# EAGLE design Thruster Ctl (EAGLE 5.06)
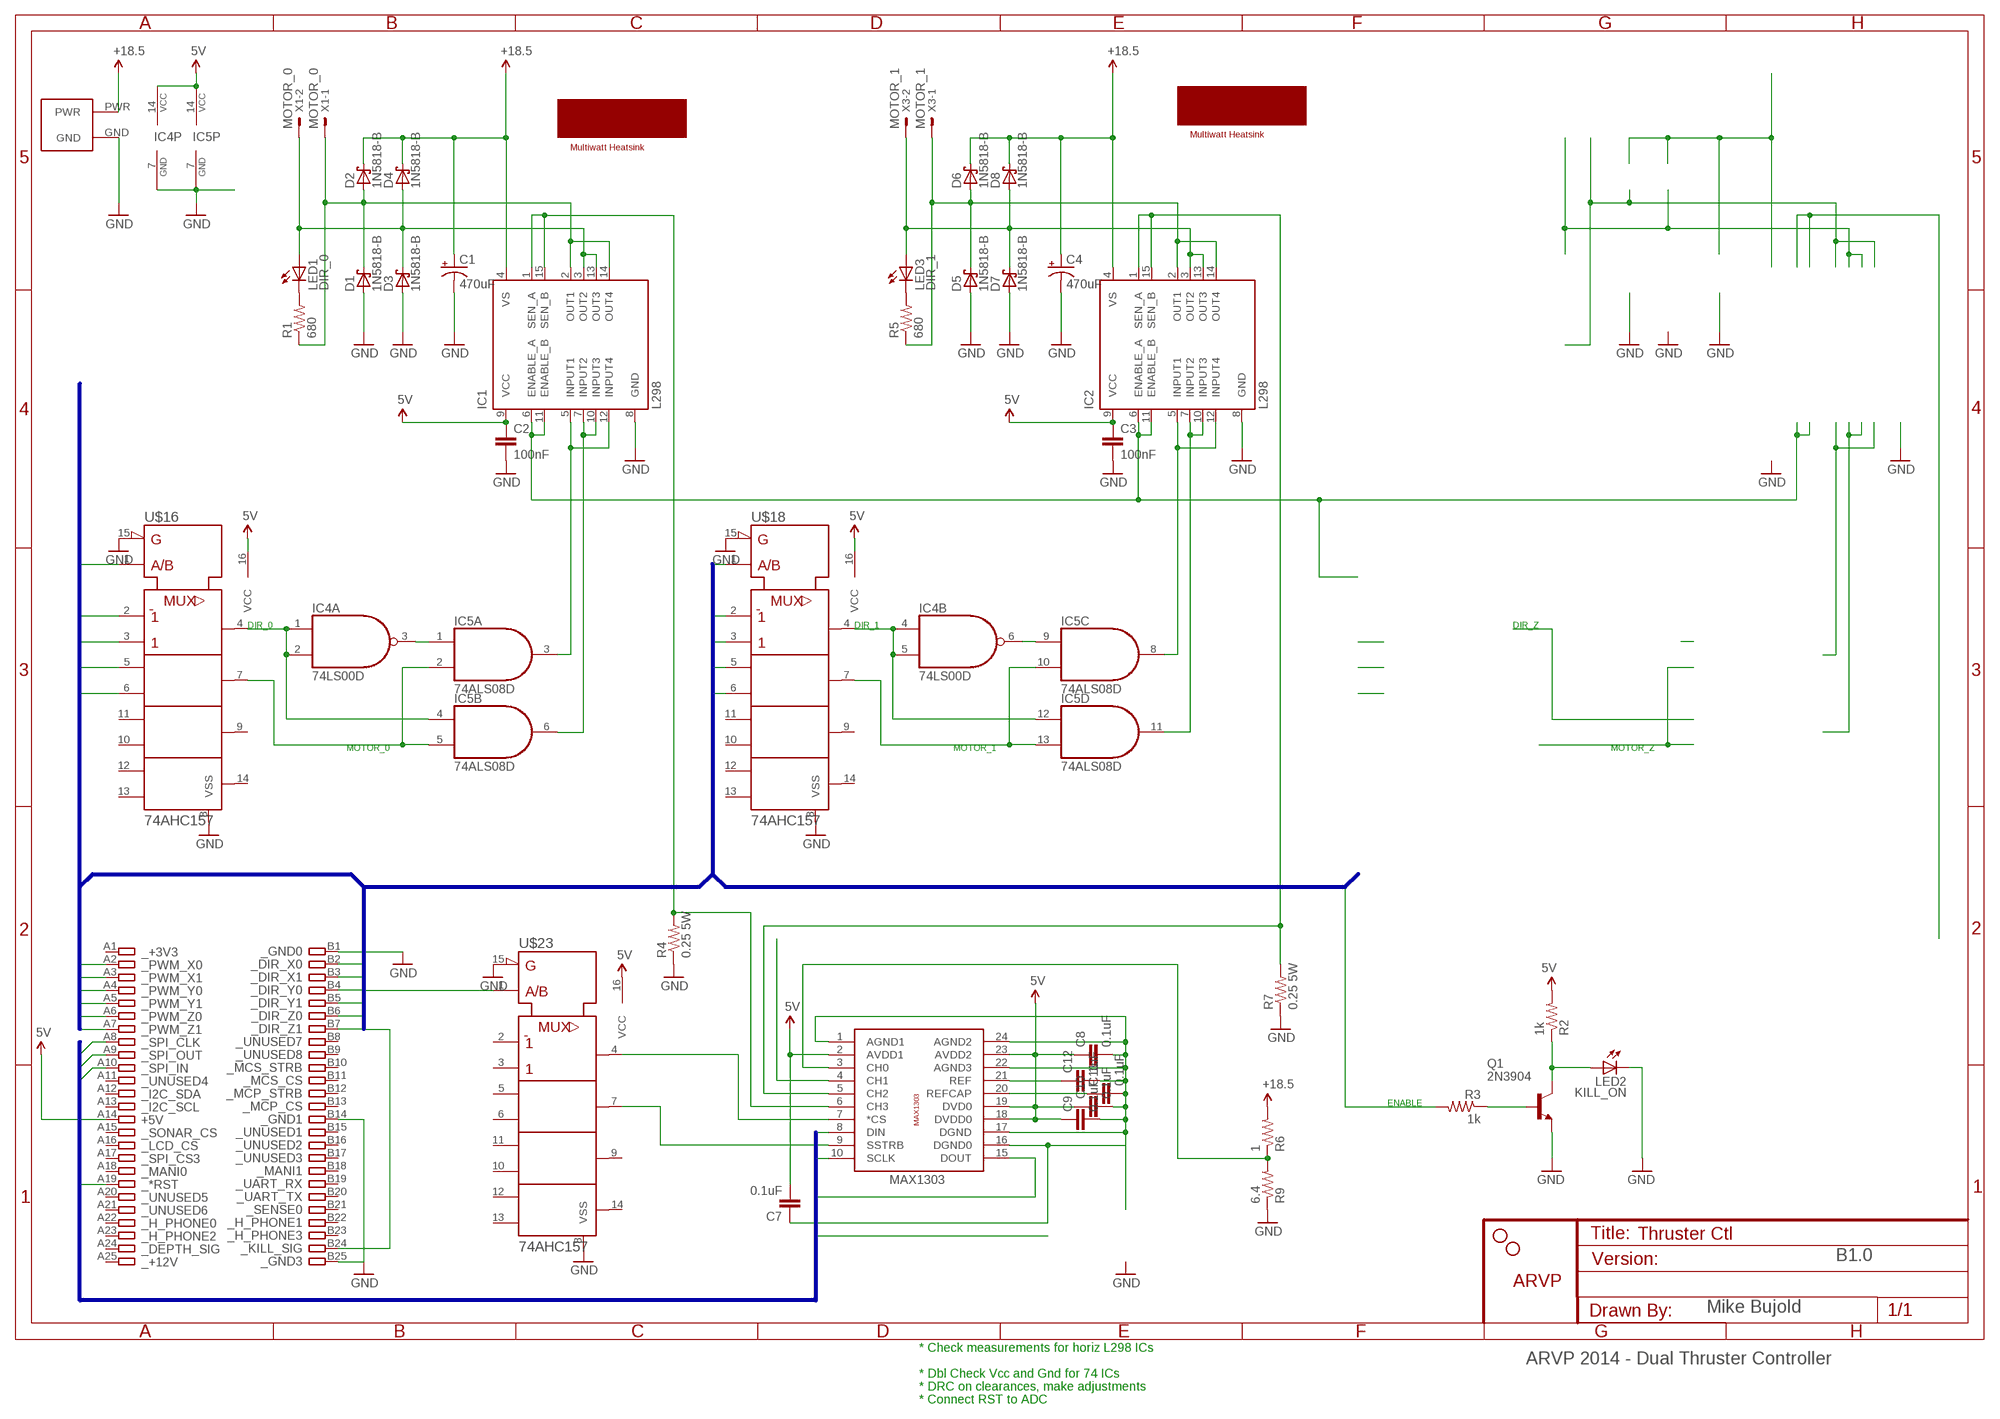
[diagram p0: schematic, sheet 1]

## Parts
C1  470uF  CAP_POLPTH4  [CPOL-RADIAL-1000UF-25V]
C2  100nF  CAPPTH  [CAP-PTH-SMALL]
C3  100nF  CAPPTH  [CAP-PTH-SMALL]
C4  470uF  CAP_POLPTH4  [CPOL-RADIAL-1000UF-25V]
C7  0.1uF  CAP1206  [1206]
C8  0.1uF  CAP1206  [1206]
C9  0.1uF  CAP1206  [1206]
C10  0.1uF  CAP1206  [1206]
C11  0.1uF  CAP1206  [1206]
C12  1uF  CAP1206  [1206]
D1  1N5818-B  [DO41-7.6]
D2  1N5818-B  [DO41-7.6]
D3  1N5818-B  [DO41-7.6]
D4  1N5818-B  [DO41-7.6]
D5  1N5818-B  [DO41-7.6]
D6  1N5818-B  [DO41-7.6]
D7  1N5818-B  [DO41-7.6]
D8  1N5818-B  [DO41-7.6]
IC1  L298  [MULTIWATT-15]
IC2  L298  [MULTIWATT-15]
IC4  74LS00D  [SO14]
IC5  74ALS08D  [SO14]
JP1  STAND-OFF  [STAND-OFF]
JP4  STAND-OFF  [STAND-OFF]
LED1  DIR_0  LED5MM  [LED5MM]
LED2  KILL_ON  LED5MM  [LED5MM]
LED3  DIR_1  LED5MM  [LED5MM]
Q1  2N3904  [TO92]
R1  680  RESISTORPTH-1/4W  [AXIAL-0.4]
R2  1k  RESISTORPTH-1/4W  [AXIAL-0.4]
R3  1k  RESISTORPTH-1/4W  [AXIAL-0.4]
R4  0.25 5W  R-US_0922/22  [0922/22]
R5  680  RESISTORPTH-1/4W  [AXIAL-0.4]
R6  1  RESISTORPTH-1/4W  [AXIAL-0.4]
R7  0.25 5W  R-US_0922/22  [0922/22]
R9  6.4  RESISTORPTH-1/4W  [AXIAL-0.4]
U$4  ARVP_LOGO  [ARVP]
U$7  AND_PWR  [AND_PWR]
U$9  L298_HS  [HEATSINK_MW]
U$10  L298_HS  [HEATSINK_MW]
U$13  MAX1303  [MAX1303]
U$16  74AHC157  74AHC157SO16  [SO16]
U$18  74AHC157  74AHC157SO16  [SO16]
U$19  CARD_50PIN  [CARD_50PIN]
U$23  74AHC157  74AHC157SO16  [SO16]
X1  MOTOR_0  KK-156-2  [KK-156-2]
X3  MOTOR_1  KK-156-2  [KK-156-2]

## Nets
5V: C2.1 C3.1 C7.2 C8.1 C9.1 C10.1 IC1.9(VCC) IC2.9(VCC) IC4.14(P:VCC) IC5.14(P:VCC) R2.P$2 U$13.2(AVDD1) U$13.18(DVDD0) U$13.19(DVD0) U$13.23(AVDD2) U$16.16(VCC) U$18.16(VCC) U$19.A14 U$23.16(VCC)
18.5V: C1.1(+) C4.1(+) D2.C D4.C D6.C D8.C IC1.4(VS) IC2.4(VS) R6.P$2 U$7.PWR ; supply symbol labelled +18.5
*RST: U$19.A19
_SPI_CLK: U$13.10(SCLK) U$19.A8
_SPI_IN: U$13.15(DOUT) U$19.A10
_SPI_OUT: U$13.8(DIN) U$19.A9
DIR_X0: U$16.3(1B) U$19.B2
DIR_X1: U$16.2(1A) U$19.B3
DIR_Y0: U$18.3(1B) U$19.B4
DIR_Y1: U$18.2(1A) U$19.B5
DIR_Z0: U$19.B6
DIR_Z1: U$19.B7
GND: C1.2(-) C2.2 C3.2 C4.2(-) D1.A D3.A D5.A D7.A IC1.8(GND) IC2.8(GND) IC4.7(P:GND) IC5.7(P:GND) LED2.K(C) Q1.3(E) R4.1 R7.1 R9.P$1 U$7.GND U$16.8(VSS) U$16.15(!G) U$18.8(VSS) U$18.15(!G) U$19.B1 U$19.B14 U$19.B25 U$23.8(VSS) U$23.15(!G)
KILL: IC1.6(ENABLE_A) IC1.11(ENABLE_B) IC2.6(ENABLE_A) IC2.11(ENABLE_B) R3.P$2 U$19.B24
N$1: IC5.10(C:I1) IC5.13(D:I1) U$18.7(2Y)
N$3: LED2.A Q1.1(C) R2.P$1
N$4: IC2.5(INPUT1) IC2.12(INPUT4) IC5.8(C:O)
N$5: IC1.5(INPUT1) IC1.12(INPUT4) IC5.3(A:O)
N$6: IC1.7(INPUT2) IC1.10(INPUT3) IC5.6(B:O)
N$7: D1.C D2.A IC1.2(OUT1) IC1.14(OUT4) R1.P$1 X1.1
N$8: D3.C D4.A IC1.3(OUT2) IC1.13(OUT3) LED1.A X1.2
N$9: LED1.K(C) R1.P$2
N$10: IC2.7(INPUT2) IC2.10(INPUT3) IC5.11(D:O)
N$11: D5.C D6.A IC2.2(OUT1) IC2.14(OUT4) R5.P$1 X3.1
N$12: D7.C D8.A IC2.3(OUT2) IC2.13(OUT3) LED3.A X3.2
N$14: LED3.K(C) R5.P$2
N$15: U$13.4(CH1)
N$22: C7.1 C8.2 C9.2 C10.2 C11.2 C12.2 U$13.1(AGND1) U$13.16(DGND0) U$13.17(DGND) U$13.22(AGND3) U$13.24(AGND2)
N$25: IC4.6(B:O) IC5.9(C:I0)
N$26: IC5.2(A:I1) IC5.5(B:I1) U$16.7(2Y)
N$27: IC4.3(A:O) IC5.1(A:I0)
N$28: Q1.2(B) R3.P$1
N$29: IC2.1(SEN_A) IC2.15(SEN_B) R7.2 U$13.5(CH2)
N$30: IC1.1(SEN_A) IC1.15(SEN_B) R4.2 U$13.6(CH3)
N$32: U$13.7(*CS) U$23.4(1Y)
N$33: C11.1 U$13.20(REFCAP)
N$34: C12.1 U$13.21(REF)
N$35: U$13.9(SSTRB) U$23.7(2Y)
N$36: IC4.1(A:I0) IC4.2(A:I1) IC5.4(B:I0) U$16.4(1Y)
N$37: IC4.4(B:I0) IC4.5(B:I1) IC5.12(D:I0) U$18.4(1Y)
N$39: R6.P$1 R9.P$2 U$13.3(CH0)
PWM_X0: U$16.6(2B) U$19.A2
PWM_X1: U$16.5(2A) U$19.A3
PWM_Y0: U$18.6(2B) U$19.A4
PWM_Y1: U$18.5(2A) U$19.A5
PWM_Z0: U$19.A6
PWM_Z1: U$19.A7
SEL_X: U$16.1(!A/B)
SEL_Y: U$18.1(!A/B)
SIDE: U$23.1(!A/B)
Unconnected: IC4.8(C:O) IC4.9(C:I0) IC4.10(C:I1) IC4.11(D:O) IC4.12(D:I0) IC4.13(D:I1) U$16.9(3Y) U$16.10(3B) U$16.11(3A) U$16.12(4A) U$16.13(4B) U$16.14(4Y) U$18.9(3Y) U$18.10(3B) U$18.11(3A) U$18.12(4A) U$18.13(4B) U$18.14(4Y) U$19.A1 U$19.A11 U$19.A12 U$19.A13 U$19.A15 U$19.A16 U$19.A17 U$19.A18 U$19.A20 U$19.A21 U$19.A22 U$19.A23 U$19.A24 U$19.A25 U$19.B8 U$19.B9 U$19.B10 U$19.B11 U$19.B12 U$19.B13 U$19.B15 U$19.B16 U$19.B17 U$19.B18 U$19.B19 U$19.B20 U$19.B21 U$19.B22 U$19.B23 U$23.2(1A) U$23.3(1B) U$23.5(2A) U$23.6(2B) U$23.9(3Y) U$23.10(3B) U$23.11(3A) U$23.12(4A) U$23.13(4B) U$23.14(4Y)

## Buses
_SPI_IN,_SPI_OUT,_SPI_CLK,_ADC_CS,ADC_STRB,*RST
PWM_X0,DIR_X0,PWM_X1,DIR_X1,PWM_Y0,DIR_Y0,PWM_Y1,DIR_Y1,PWM_Z0,DIR_Z0,PWM_Z1,DIR_Z1,SEL_X,SEL_Y,SEL_Z,KILL,SIDE

## Notes on the sheet
- DIR_0 | DIR_1 | DIR_Z
- MOTOR_0 | MOTOR_1 | MOTOR_Z
- ENABLE
- B1.0
- Mike Bujold
- * Check measurements for horiz L298 ICs
- ARVP 2014 - Dual Thruster Controller
- * Dbl Check Vcc and Gnd for 74 ICs
- * DRC on clearances, make adjustments
- * Connect RST to ADC

## Library data of the parts
C1 C4 = SparkFun:CAP_POL: Capacitor Polarized These are standard SMD and PTH capacitors. Normally 10uF, 47uF, and 100uF in electrolytic and tantalum varieties. Always verify the external diameter of the through hole cap, it varies with capacity, voltage, and manufacturer. The EIA devices should be standard.
C2 C3 C7-C12 = SparkFun:CAP: Capacitor Standard 0603 ceramic capacitor, and 0.1" leaded capacitor.
D1-D8 = diode:1N581*: 1.0A SCHOTTKY BARRIER RECTIFIER Source: http://www.diodes.com/datasheets/ds23001.pdf
IC1 IC2 = st-microelectronics:L298: DUAL FULL-BRIDGE DRIVER
IC4 = 74xx-us:74*00: Quad 2-input NAND gate
IC5 = 74xx-us:74*08: Quad 2-input AND gate
JP1 JP4 = SparkFun:STAND-OFF: Stand Off This is the mechanical footprint for a #4 phillips button head screw. Use the keepout ring to avoid running the screw head into surrounding components. SKU : PRT-00447
LED1-LED3 = led:LED: LED OSRAM: - CHIPLED LG R971, LG N971, LY N971, LG Q971, LY Q971, LO R971, LY R971 LH N974, LH R974 LS Q976, LO Q976, LY Q976 LO Q996 - Hyper CHIPLED LW Q18S LB Q993, LB Q99A, LB R99A - SideLED LS A670, LO A670, LY A670, LG A670, LP A670 LB A673, LV A673, LT A673, LW A673 LH A674 LY A675 LS A676, LA A676, LO A676, LY A676, LW A676 LS A679, LY A679, LG A679 - Hyper Micro SIDELED® LS Y876, LA Y876, LO Y876, LY Y876 LT Y87S - SmartLED LW L88C, LW L88S LB L89C, LB L89S, LG L890 LS L89K, LO L89K, LY L89K LS L896, LA L896, LO L896, LY L896 - TOPLED LS T670, LO T670, LY T670, LG T670, LP T670 LSG T670, LSP T670, LSY T670, LOP T670, LYG T670 LG T671, LOG T671, LSG T671 LB T673, LV T673, LT T673, LW T673 LH T674 LS T676, LA T676, LO T676, LY T676, LB T676, LH T676, LSB T676, LW T676 LB T67C, LV T67C, LT T67C, LS T67K, LO T67K, LY T67K, LW E67C LS E67B, LA E67B, LO E67B, LY E67B, LB E67C, LV E67C, LT E67C LW T67C LS T679, LY T679, LG T679 LS T770, LO T770, LY T770, LG T770, LP T770 LB T773, LV T773, LT T773, LW T773 LH T774 LS E675, LA E675, LY E675, LS T675 LS T776, LA T776, LO T776, LY T776, LB T776 LHGB T686 LT T68C, LB T68C - Hyper Mini TOPLED® LB M676 - Mini TOPLED Santana® LG M470 LS M47K, LO M47K, LY M47K Source: http://www.osram.convergy.de LUXEON: - LUMILED® LXK2-PW12-R00, LXK2-PW12-S00, LXK2-PW14-U00, LXK2-PW14-V00 LXK2-PM12-R00, LXK2-PM12-S00, LXK2-PM14-U00 LXK2-PE12-Q00, LXK2-PE12-R00, LXK2-PE12-S00, LXK2-PE14-T00, LXK2-PE14-U00 LXK2-PB12-K00, LXK2-PB12-L00, LXK2-PB12-M00, LXK2-PB14-N00, LXK2-PB14-P00, LXK2-PB14-Q00 LXK2-PR12-L00, LXK2-PR12-M00, LXK2-PR14-Q00, LXK2-PR14-R00 LXK2-PD12-Q00, LXK2-PD12-R00, LXK2-PD12-S00 LXK2-PH12-R00, LXK2-PH12-S00 LXK2-PL12-P00, LXK2-PL12-Q00, LXK2-PL12-R00 Source: www.luxeon.com KINGBRIGHT: KA-3528ASYC Source: www.kingbright.com
Q1 = transistor-npn:2N3904: NPN Transistor
R1-R3 R5 R6 R9 = SparkFun:RESISTOR: Resistor Basic schematic elements and footprints for 0603, 1206, and PTH resistors.
R4 R7 = resistor:R-US_: RESISTOR, American symbol
U$4 = ARVP:ARVP_LOGO
U$7 = ARVP:AND_PWR
U$9 U$10 = ARVP:L298_HS
U$13 = ARVP:MAX1303
U$16 U$18 U$23 = ARVP:74AHC157
U$19 = ARVP:CARD_50PIN
X1 X3 = con-molex:KK-156-2: KK 156 HEADER Source: http://www.molex.com/pdm_docs/sd/026604100_sd.pdf

## Board
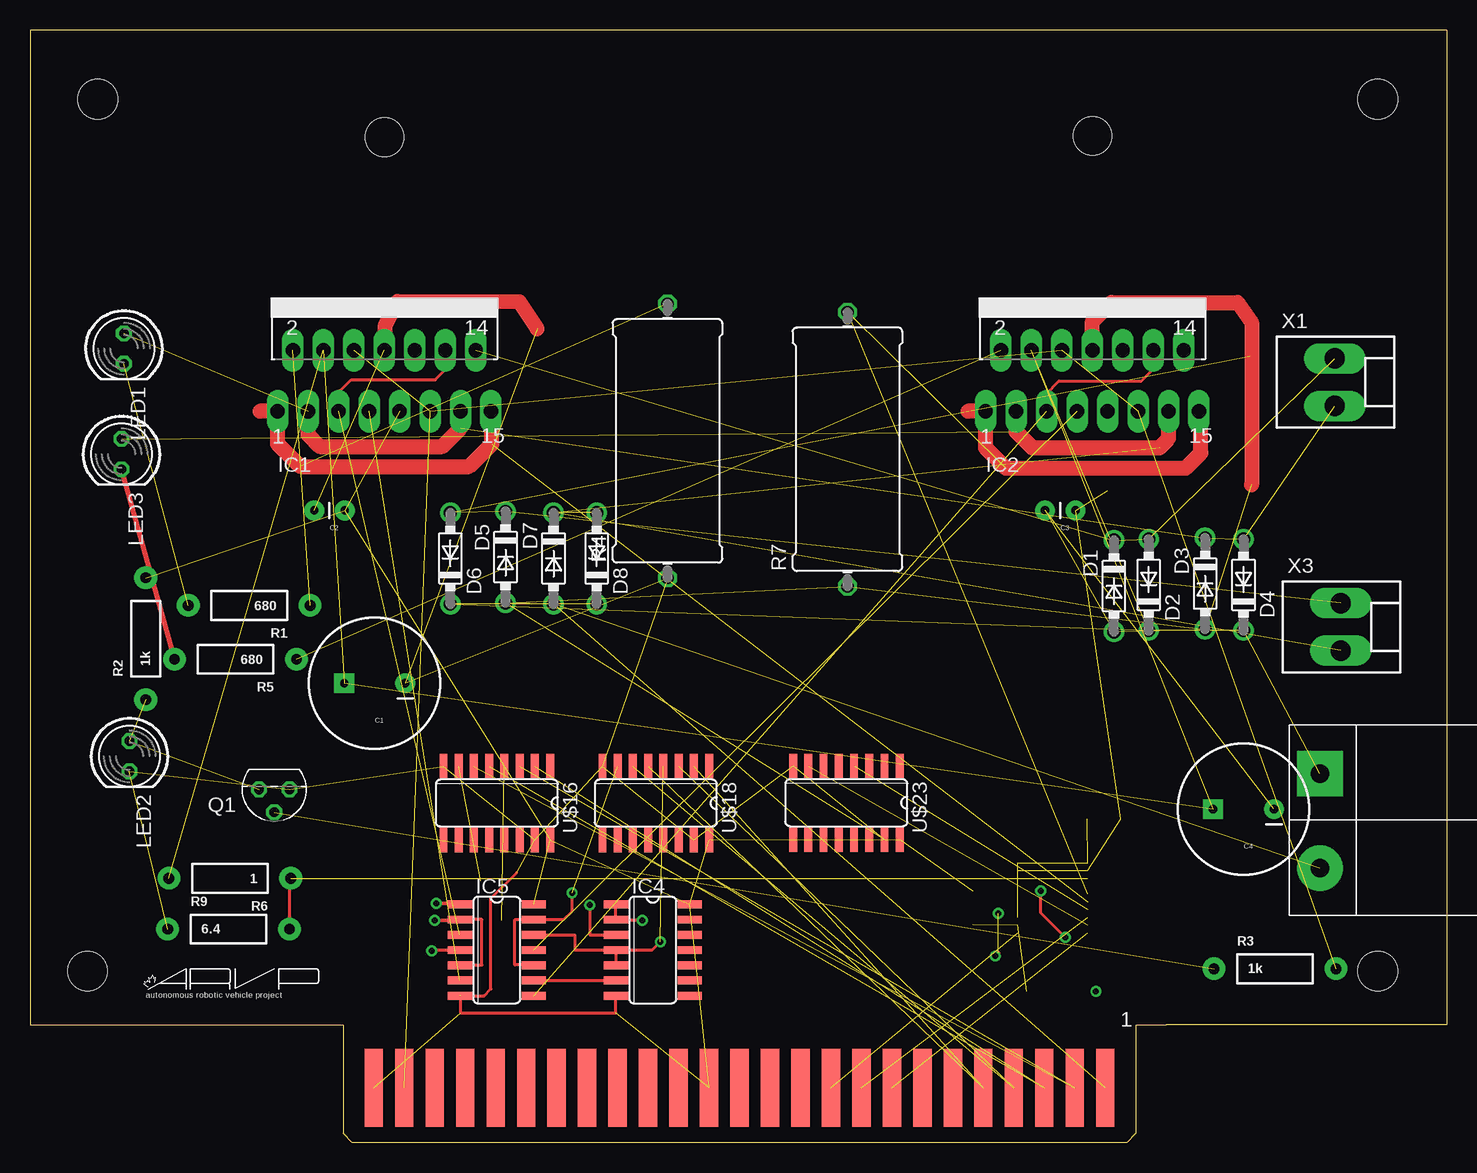
[diagram p1: board, top side]
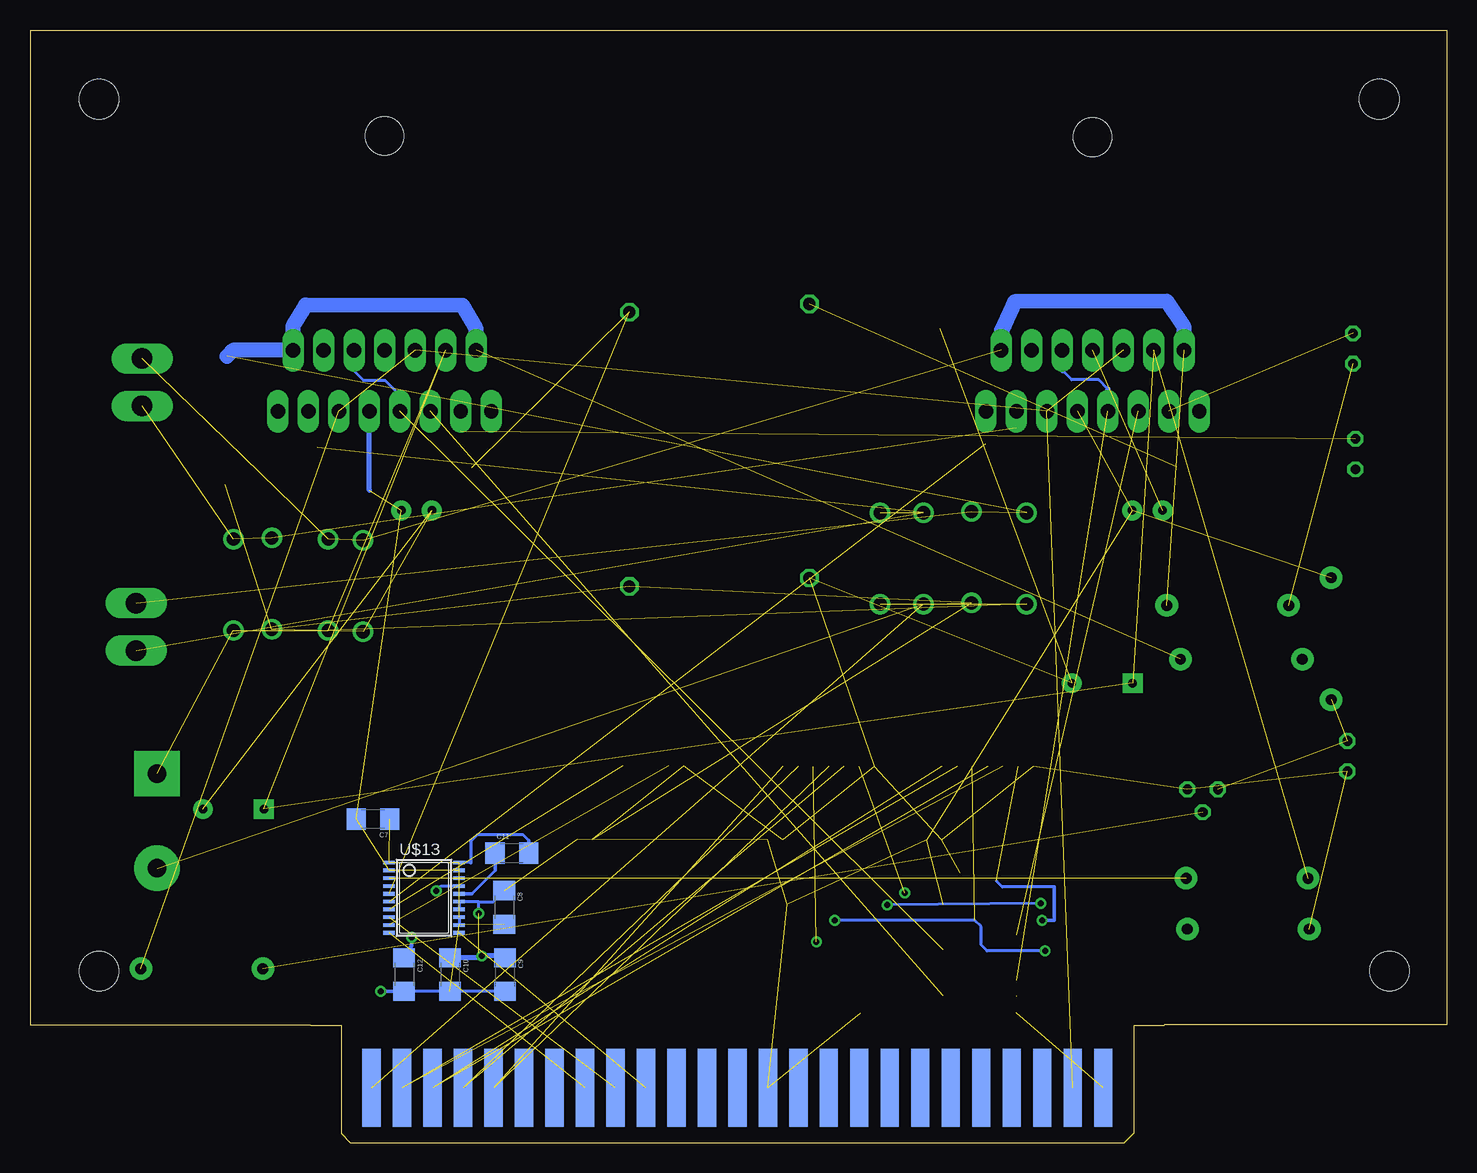
[diagram p2: board, bottom side, seen from below]

Size 118.08 x 92.75 mm. Coordinates in mm from the lower left corner, seen from the top.
Outline: 23.58,9.8 0.01,9.8 0,92.75 118.07,92.75 118.08,9.8 94.68,9.8
Copper layers (1*16): Top 0.035mm / dielectric 1.5mm / Bottom 0.035mm
Design rules "default *": minimum track width 10mil, minimum drill 19mil, track to track 7mil, track to pad 7mil, pad to pad 7mil, via to via 7mil, smd to smd 7mil, copper to edge 10mil, drill to drill 8mil, minimum pad ring 10mil, minimum via ring 8mil, stop-mask expansion 4mil, vias tented up to drill 0mil, thermal gap 10mil

### Footprints (pad centres in the part's own frame; a part is rotated, then mirrored left to right if it is on the bottom)
CPOL-RADIAL-1000UF-25V = drill 0.7 pad 1.651 square: 1 2.54,0 | drill 0.7 pad 1.651 round: 2 -2.54,0
CAP-PTH-SMALL = drill 0.7 pad 1.651 round: 1 0,0; 2 2.54,0
1206 = smd 1.6 x 1.8: 1 -1.4,0; 2 1.4,0
DO41-7.6 = drill 1.1 pad 1.7 round: A 3.81,0; C -3.81,0
MULTIWATT-15 = drill 1.2 long: 1 -8.89,-7.62; 2 -7.62,-2.54; 3 -6.35,-7.62; 4 -5.08,-2.54; 5 -3.81,-7.62; 6 -2.54,-2.54; 7 -1.27,-7.62; 8 0,-2.54; 9 1.27,-7.62; 10 2.54,-2.54; 11 3.81,-7.62; 12 5.08,-2.54; 13 6.35,-7.62; 14 7.62,-2.54; 15 8.89,-7.62
SO14 = smd 0.66 x 2.032: 1 -3.81,-3.073; 2 -2.54,-3.073; 3 -1.27,-3.073; 4 0,-3.073; 5 1.27,-3.073; 6 2.54,-3.073; 7 3.81,-3.073; 8 3.81,3.073; 9 2.54,3.073; 10 1.27,3.073; 11 0,3.073; 12 -1.27,3.073; 13 -2.54,3.073; 14 -3.81,3.073
STAND-OFF = hole 3.302: 0,0
LED5MM = drill 0.813 octagon: A -1.27,0; K 1.27,0
TO92 = drill 0.813 octagon: 1 1.27,0; 2 0,1.905; 3 -1.27,0
AXIAL-0.4 = drill 0.9 pad 1.88 round: P$1 -5.08,0; P$2 5.08,0
0922/22 = drill 1.016 octagon: 1 -11.43,0; 2 11.43,0
AND_PWR = drill 1.524 pad 3.81 round: GND 0,-7.886 | drill 1.524 pad 3.81 square: PWR 0,0
HEATSINK_MW = hole 3.2: 0,12.319
MAX1303 = smd 0.305 x 0.991: 1 -3.575,-2.918; 2 -2.925,-2.918; 3 -2.275,-2.918; 4 -1.625,-2.918; 5 -0.975,-2.918; 6 -0.325,-2.918; 7 0.325,-2.918; 8 0.975,-2.918; 9 1.625,-2.918; 10 2.275,-2.918; 15 2.275,2.918; 16 1.625,2.918; 17 0.975,2.918; 18 0.325,2.918; 19 -0.325,2.918; 20 -0.975,2.918; 21 -1.625,2.918; 22 -2.275,2.918; 23 -2.925,2.918; 24 -3.575,2.918
SO16 = smd 0.66 x 2.032: 1 -4.445,-3.073; 2 -3.175,-3.073; 3 -1.905,-3.073; 4 -0.635,-3.073; 5 0.635,-3.073; 6 1.905,-3.073; 7 3.175,-3.073; 8 4.445,-3.073; 9 4.445,3.073; 10 3.175,3.073; 11 1.905,3.073; 12 0.635,3.073; 13 -0.635,3.073; 14 -1.905,3.073; 15 -3.175,3.073; 16 -4.445,3.073
CARD_50PIN = smd 1.524 x 6.477: A1 30.48,5.08; A2 27.94,5.08; A3 25.4,5.08; A4 22.86,5.08; A5 20.32,5.08; A6 17.78,5.08; A7 15.24,5.08; A8 12.7,5.08; A9 10.16,5.08; A10 7.62,5.08; A11 5.08,5.08; A12 2.54,5.08; A13 0,5.08; A14 -2.54,5.08; A15 -5.08,5.08; A16 -7.62,5.08; A17 -10.16,5.08; A18 -12.7,5.08; A19 -15.24,5.08; A20 -17.78,5.08; A21 -20.32,5.08; A22 -22.86,5.08; A23 -25.4,5.08; A24 -27.94,5.08; A25 -30.48,5.08 | smd 1.524 x 6.477 bottom: B1 30.48,5.08; B2 27.94,5.08; B3 25.4,5.08; B4 22.86,5.08; B5 20.32,5.08; B6 17.78,5.08; B7 15.24,5.08; B8 12.7,5.08; B9 10.16,5.08; B10 7.62,5.08; B11 5.08,5.08; B12 2.54,5.08; B13 0,5.08; B14 -2.54,5.08; B15 -5.08,5.08; B16 -7.62,5.08; B17 -10.16,5.08; B18 -12.7,5.08; B19 -15.24,5.08; B20 -17.78,5.08; B21 -20.32,5.08; B22 -22.86,5.08; B23 -25.4,5.08; B24 -27.94,5.08; B25 -30.48,5.08
KK-156-2 = drill 1.7 pad 2.184 long: 1 -1.98,0; 2 1.98,0

### Placement (x,y rotation side)
C1  28.73,38.3 180 top
C2  26.23,52.7 180 top
C3  87.13,52.7 180 top
C4  101.13,27.8 180 top
C7  89.49,26.96 180 bottom
C8  78.56,19.59 270 bottom
C9  78.5,14.01 270 bottom
C10  83.07,14.01 270 bottom
C11  77.92,24.14 0 bottom
C12  86.89,14.01 270 bottom
D1  90.33,46.4 270 top
D2  93.23,46.5 90 top
D3  97.93,46.6 270 top
D4  101.13,46.5 90 top
D5  39.63,48.8 270 top
D6  35.03,48.7 90 top
D7  43.63,48.7 270 top
D8  47.23,48.7 90 top
IC1  29.53,68.6 0 top
IC2  88.53,68.6 0 top
IC4  51.9,16.05 270 top
IC5  38.9,16.05 270 top
JP1  4.79,14.3 0 top
JP2  STAND-OFF  [STAND-OFF]  112.33,86.97 0 top
JP3  STAND-OFF  [STAND-OFF]  5.65,86.97 0 top
JP4  112.33,14.3 0 top
LED1  7.83,66.2 270 top
LED2  8.29,32.21 270 top
LED3  7.63,57.4 270 top
Q1  20.36,29.45 180 top
R1  18.27,44.78 180 top
R2  9.65,42 90 top
R3  103.75,14.49 0 top
R4  53.13,58.5 90 top
R5  17.13,40.3 180 top
R6  16.65,22.03 180 top
R7  68.13,57.8 90 top
R9  16.55,17.79 0 top
U$4  9.62,12.05 0 top
U$7  107.49,30.76 0 top
U$9  29.53,71.5 0 top
U$10  88.53,71.6 0 top
U$13  85.24,19.76 270 bottom
U$16  38.9,28.3 180 top
U$18  52.15,28.3 180 top
U$19  59.13,-0.51 0 top
U$23  68.03,28.33 180 top
X1  108.73,63.4 270 top
X3  109.23,43 270 top

### Tracks (layer width: path | path; a pad name or v marks a point on that pad's centre or on a via)
5V  (via drill 0.5)  (15 unrouted)
  Top 0.406: v80.43,15.55 80.68,15.8
  Bottom 0.254: U$13.18 U$13.19 80.68,20.08 | C8.1 79.47,20.08 80.68,20.08 | v80.68,19.1 80.68,20.08
  Bottom 0.406: 89.8,54.37 IC2.9 | C9.1 78.64,15.55 v80.43,15.55 80.57,15.41 C10.1
18.5V  (9 unrouted)
_SPI_CLK  (1 unrouted)
_SPI_IN  (1 unrouted)
_SPI_OUT  (1 unrouted)
DIR_X0  (1 unrouted)
DIR_X1  (1 unrouted)
DIR_Y0  (1 unrouted)
DIR_Y1  (1 unrouted)
GND  (26 unrouted)
  Top 0.254: 35.9,12.24 35.9,10.8 48.83,10.8 IC4.7 | 40.55,22.48 38.4,20.34 38.4,12.8 37.84,12.24 IC5.7
  Top 1.27: 42.25,67.84 40.79,70.1 30.6,70.13 29.62,68.17 29.62,66.15 IC1.8 | IC2.8 88.53,68.45 90.11,70.04 100.64,70.04 101.81,68.36 101.81,54.84
KILL  (5 unrouted)
N$1  (via drill 0.5)  (1 unrouted)
  Top 0.254: 41.97,14.8 40.4,14.8 40.4,18.59 IC5.13 44.48,18.59 45.17,19.28 v45.17,20.81
  Top 0.406: IC5.10 41.97,14.8
N$3  (2 unrouted)
N$4  (1 unrouted)
  Top 0.254: 84.72,62.46 85.74,63.48 92.61,63.48 93.57,64.45 93.57,66.02
  Top 0.406: IC2.5 84.72,62.46 | 93.57,66.02 IC2.12
N$5  (1 unrouted)
  Top 0.254: IC1.12 34.61,64.43 33.78,63.6 26.78,63.6 25.78,62.6
  Top 0.406: 25.78,62.6 25.78,61.04 IC1.5
N$6  (1 unrouted)
  Bottom 0.254: 28.26,62.83 29.03,63.6 31.28,63.6 32.03,64.35
  Bottom 0.406: IC1.7 28.26,62.83 | 32.03,64.35 32.03,66.02 IC1.10
N$7  (4 unrouted)
  Bottom 1.27: IC1.2 21.91,67.98 23.33,70.14 36.02,70.09 37.1,67.72 37.03,66.18 IC1.14
N$8  (4 unrouted)
  Top 1.27: IC1.3 23.18,59 24.14,58.04 34.37,58.04 35.89,59.56 35.89,60.96 IC1.13
N$9  (1 unrouted)
N$10  (1 unrouted)
  Bottom 0.254: 87.26,62.3 88.49,63.53 90.27,63.53 91.13,64.39 91.13,65.99
  Bottom 0.406: IC2.7 87.26,62.3 | 91.13,65.99 IC2.10
N$11  (4 unrouted)
  Bottom 1.27: IC2.2 80.91,67.85 82.03,69.78 95.1,69.83 96.17,68.06 96.17,66.08 IC2.14 101.16,66.06 101.66,65.56
N$12  (4 unrouted)
  Top 1.27: IC2.3 82.18,59.26 83.5,57.93 94.13,57.93 94.89,58.7 94.89,60.96 IC2.13
N$14
  Top 0.406: R5.P$2 LED3.K
N$22  (via drill 0.5)  (6 unrouted)
  Bottom 0.254: U$13.17 U$13.16 | C9.2 C10.2 C12.2 | 76.52,25.21 76.98,25.66 80.79,25.66 81.36,25.1 81.36,23.34 U$13.24
  Bottom 0.305: C11.2 76.52,25.21 | 81.36,23.34 81.36,23.33 | U$13.24 | v88.83,12.6 87.3,12.6 C12.2
  Bottom 0.406: C12.2 87.3,12.61
N$25
  Top 0.254: IC5.9 IC4.6
N$26  (via drill 0.5)  (1 unrouted)
  Top 0.254: IC5.2 37.65,18.59 37.65,14.8 35.83,14.8
  Top 0.305: 35.77,18.65 IC5.2 35.76,18.52 v33.74,18.52
  Top 0.406: IC5.5 35.83,14.8
  Bottom 0.254: 37.55,21.82 37.04,21.31 32.73,21.31
  Bottom 0.305: 32.73,21.31 32.73,18.52 v33.74,18.52
N$27  (via drill 0.5)
  Top 0.254: v46.65,19.8 46.65,17.3 48.83,17.3
  Top 0.305: IC5.1 35.74,19.95 v33.85,19.95
  Top 0.406: 48.83,17.3 IC4.3
  Bottom 0.254: v33.85,19.95 v46.65,19.8
N$28  (1 unrouted)
N$29  (2 unrouted)
  Top 1.27: 78.16,60.98 IC2.1 79.64,57.9 81.32,56.22 96.31,56.22 97.58,57.49 97.58,60.81 IC2.15
N$30  (2 unrouted)
  Top 1.27: 19.16,60.98 IC1.1 20.64,58.24 22.51,56.36 36.6,56.36 38.49,58.24 38.49,60.9 IC1.15
N$32  (1 unrouted)
N$33
  Bottom 0.254: 79.32,22.68 81.27,20.73
  Bottom 0.305: C11.1 79.32,22.68 | 81.27,20.73 U$13.20
N$34  (via drill 0.5)
  Top 0.254: v84.23,20.98 84.23,19.13 v86.26,17.1
  Bottom 0.254: U$13.21 83.83,21.38 v84.23,20.98
  Bottom 0.305: v86.26,17.1 86.26,16.44 C12.1
N$35  (1 unrouted)
N$36  (via drill 0.5)  (1 unrouted)
  Top 0.254: IC4.2 IC4.1 | IC5.4 33.55,16.05 v33.49,15.98 | v51.01,18.52 48.89,18.52
  Top 0.406: 48.89,18.52 IC4.2
  Bottom 0.254: v33.49,15.98 38.31,15.98 38.82,16.49 38.82,18.01 39.33,18.52 v51.01,18.52
N$37  (via drill 0.5)  (1 unrouted)
  Top 0.254: IC4.4 IC4.5 | IC4.4 45.4,16.05 45.4,17.3 41.97,17.3 | IC4.4 51.84,16.05 v52.54,16.74
  Top 0.406: IC5.12 41.97,17.3
N$39  (1 unrouted)
  Top 0.254: R9.P$2 21.63,21.93
  Top 0.406: 21.63,21.93 R6.P$1
PWM_X0  (1 unrouted)
PWM_X1  (1 unrouted)
PWM_Y0  (1 unrouted)
PWM_Y1  (1 unrouted)